# Altium schematic sheet SMMS1360-3R3M1_SMMS1360-3R3M.schdoc
size 127 x 99 mm
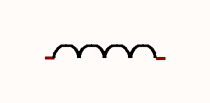
[diagram p0: SMMS1360-3R3M1_SMMS1360-3R3M.schdoc]

## Parts
L?  3.3uH  [IND-SMD_L13.8-W12.6]  (value not drawn)

## Nets

Not connected (* = marked no-connect by the designer): L? 1 2

## Library data of the parts
L? = SMMS1360-3R3M: Manufacturer: SXN(顺翔诺); Add into BOM: yes; Tolerance: ±20%; Rated Current: 16A; Saturation Current (Isat): 22A; DC Resistance (DCR): 6mΩ; Type: 一体成型电感; Symbol: SMMS1360-3R3M; Device: SMMS1360-3R3M; LCSC Part Name: 3.3uH ±20% 22A; Supplier Part: C149526; Manufacturer Part: SMMS1360-3R3M; Supplier Footprint: SMD; JLCPCB Part Class: Extended Part; Datasheet: https://atta.szlcsc.com/upload/public/pdf/source/20210810/BBF24330FB2F5029F637830BA9C42C0D.pdf; Supplier: LCSC; Convert to PCB: yes; Value: 3.3uH